# EAGLE board FPGA_S7 (EAGLE 9.6.2)
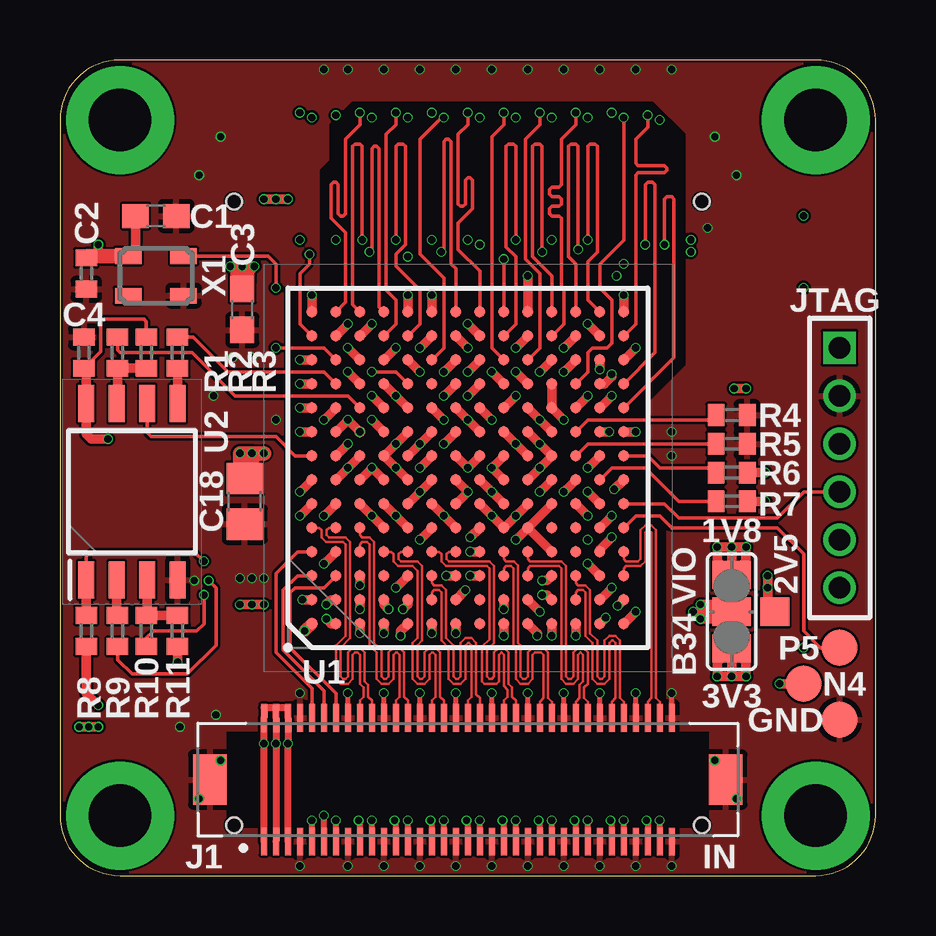
[diagram p3: board, top side]
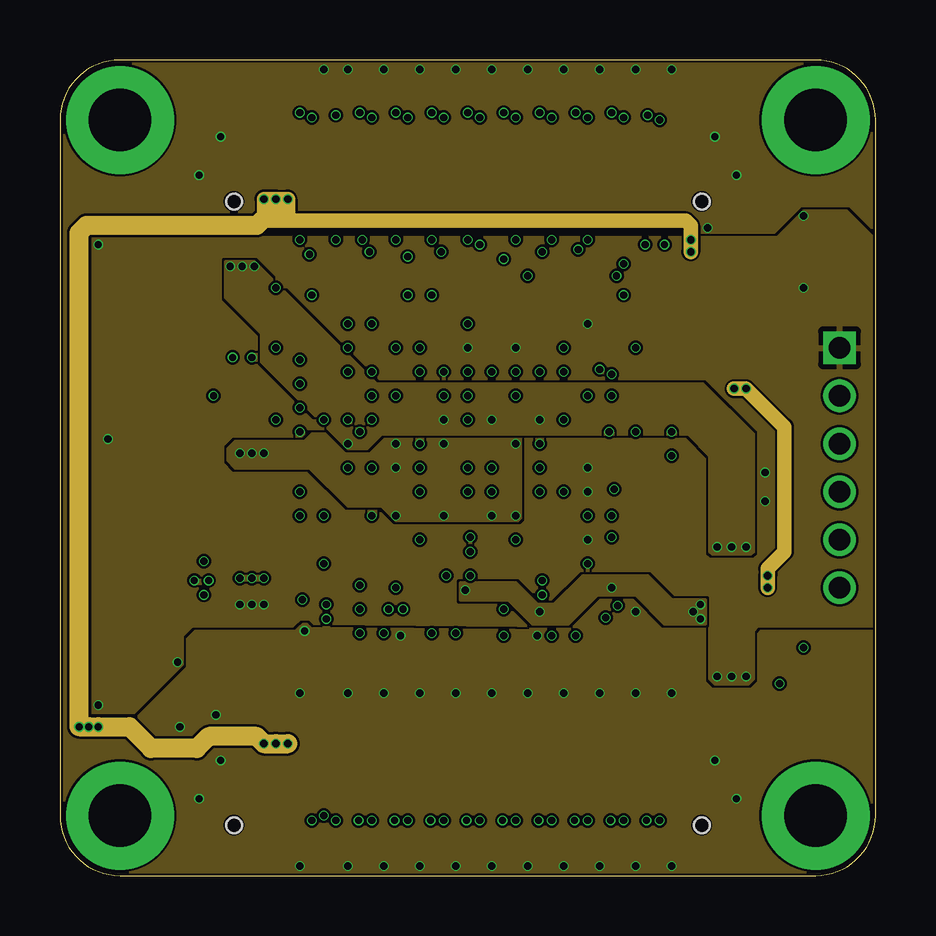
[diagram p4: board, inner layer Route2]
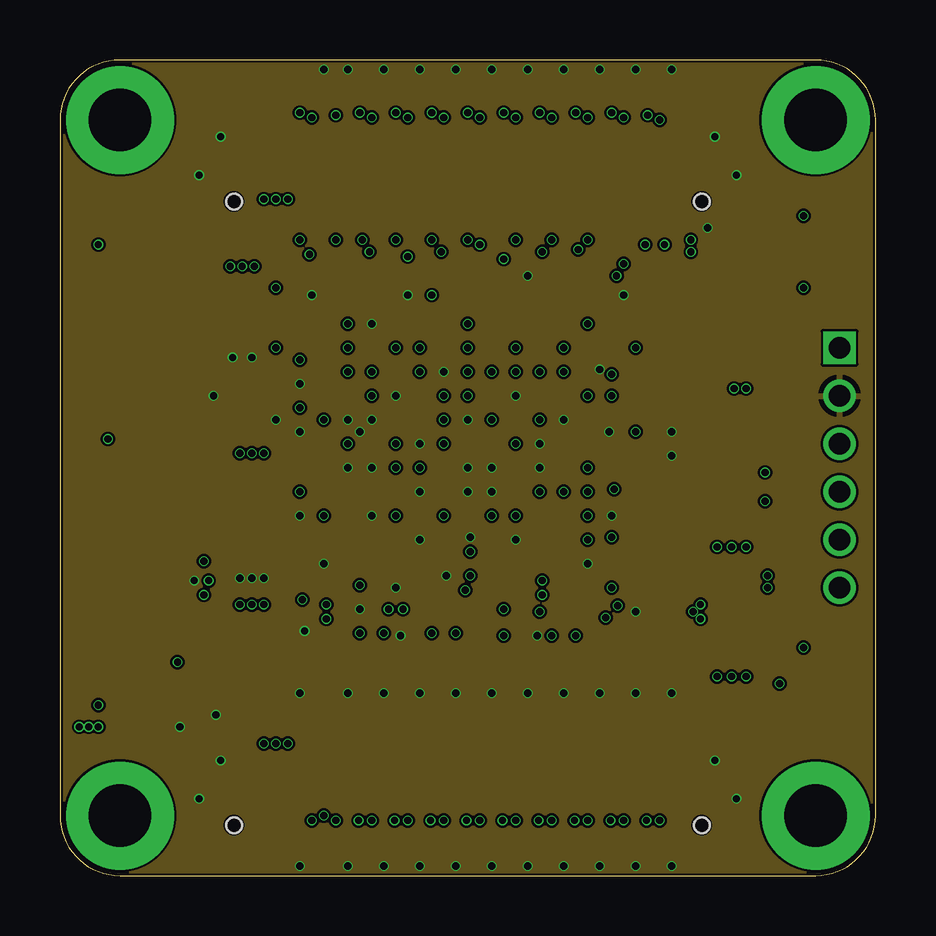
[diagram p5: board, inner layer Route3]
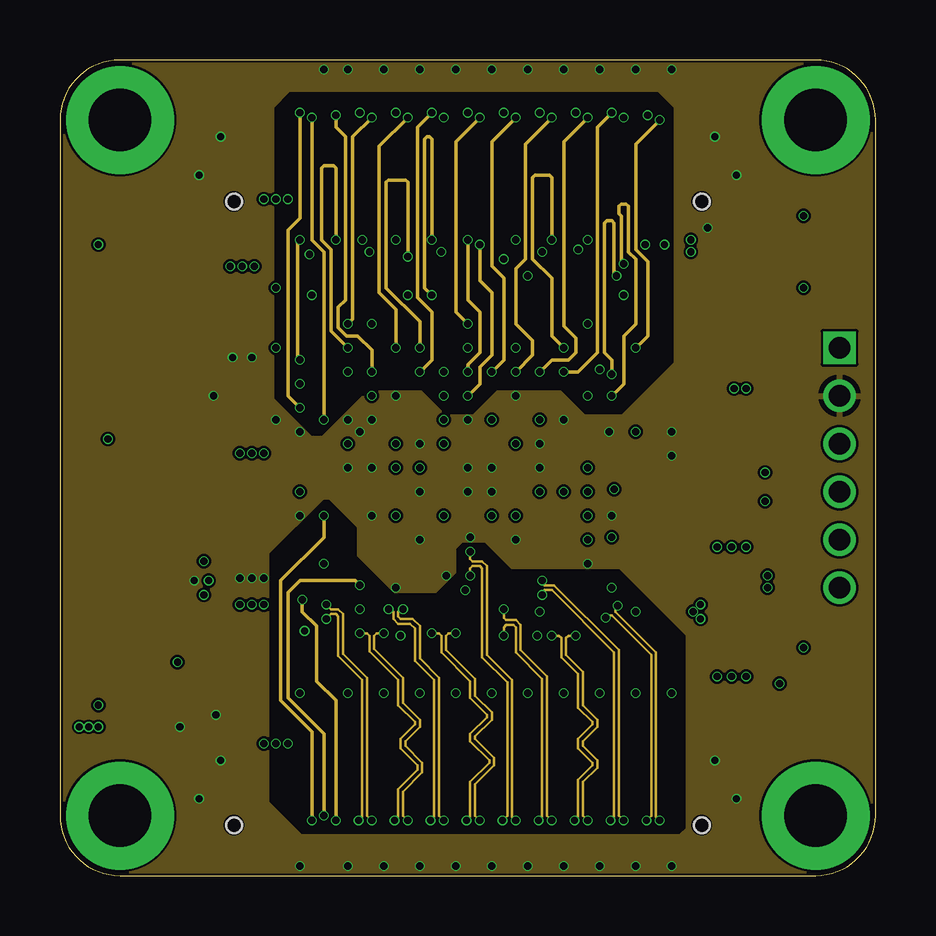
[diagram p6: board, inner layer Route14]
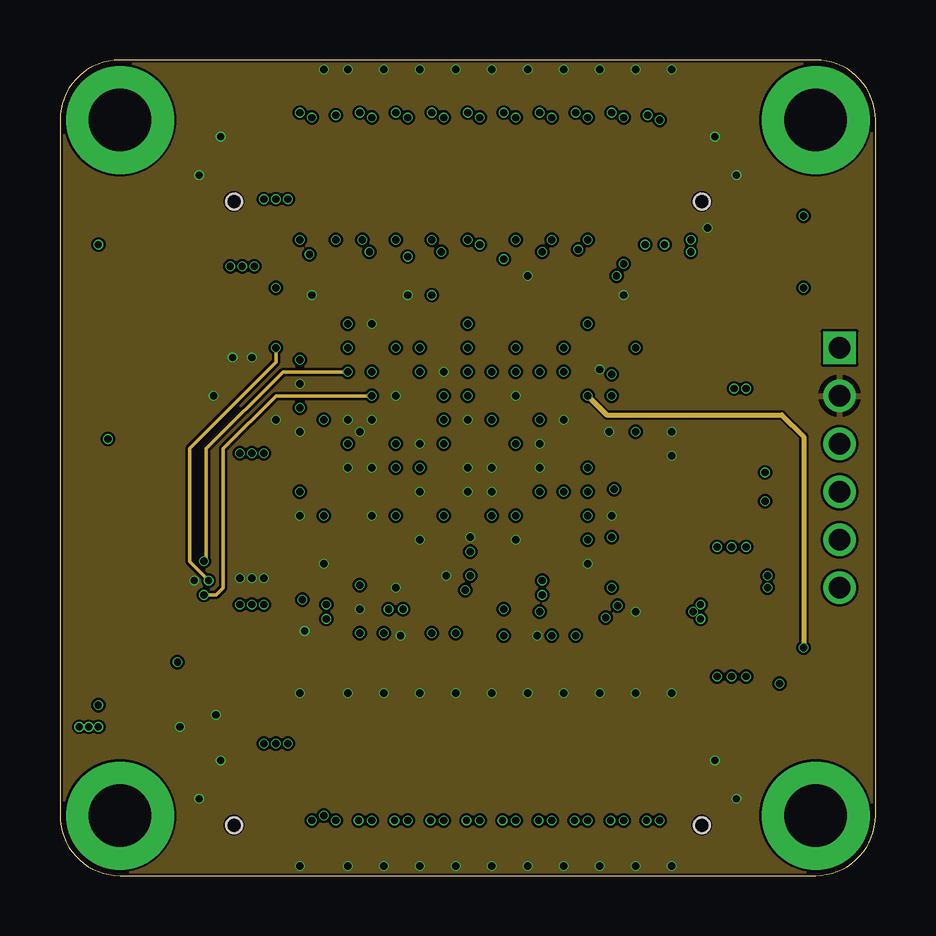
[diagram p7: board, inner layer Route15]
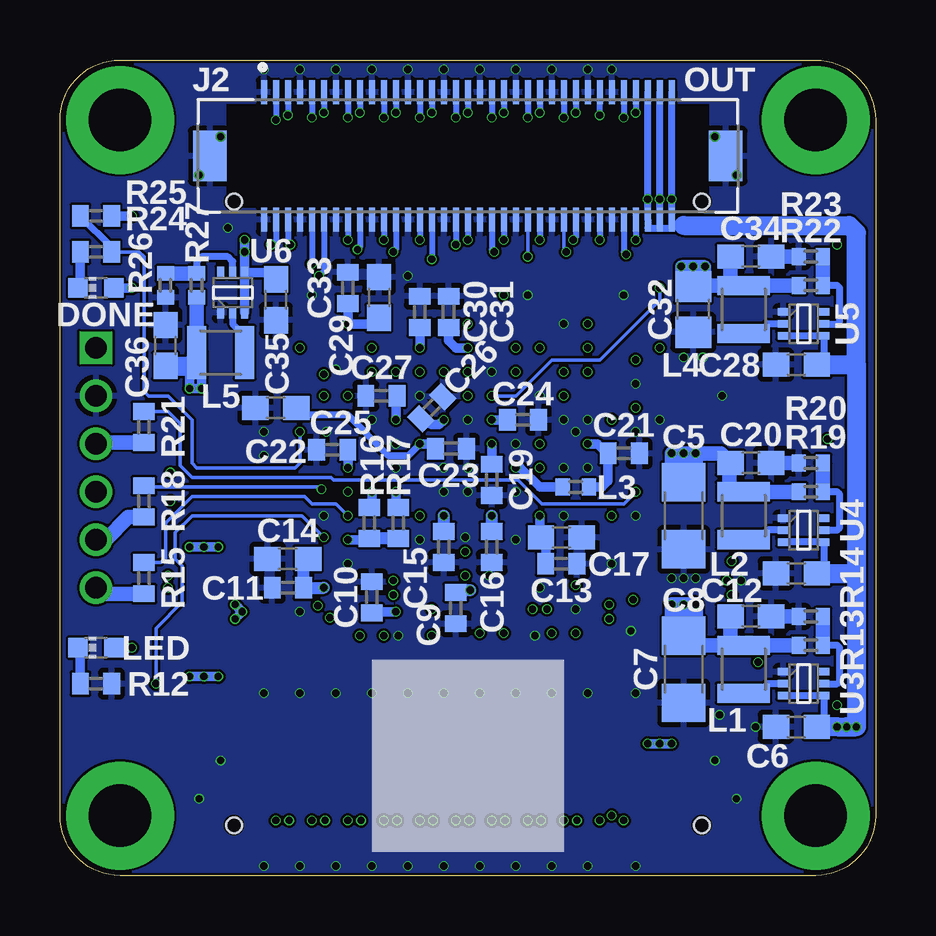
[diagram p8: board, bottom side, seen from below]

Size 34 x 34 mm. Coordinates in mm from the lower left corner, seen from the top.
Outline: 0,31.5 0,2.5 arc90 2.5,0 31.5,0 arc90 34,2.5 34,31.5 arc90 31.5,34 2.5,34 arc90 0,31.5
Copper layers (1+2*3+14*15+16): Top 0.035559375mm / dielectric 0.17018125mm / Route2 0.01778125mm / dielectric 47mil / Route3 0.0356mm / dielectric 0.2007mm / Route14 0.0356mm / dielectric 0.1499mm / Route15 0.01778125mm / dielectric 0.17018125mm / Bottom 0.035559375mm
Design rules "jlcpcb-4-layer *": minimum track width 0.08mm, minimum drill 0.2mm, track to track 0.1mm, track to pad 5mil, pad to pad 5mil, via to via 5mil, smd to smd 0mil, copper to edge 0.1mm, drill to drill 5mil, minimum pad ring 4mil, minimum via ring 0.05mm, stop-mask expansion 3mil, vias tented up to drill 100mil, thermal gap 8mil
Net classes: 0 default: width 0.14 mm, drill 0.3 mm
tRestrict: 4 lines

## Footprints (pad centres in the part's own frame; a part is rotated, then mirrored left to right if it is on the bottom)
TP12SQ = smd 1.2 x 1.2: TP 0,0
SJ_2 = smd 1.168 x 1.6: 1 -1.524,0; 2 0,0; 3 1.524,0
C0603 = smd 1.1 x 1: 1 -0.85,0; 2 0.85,0
C0402 = smd 0.7 x 0.9: 1 -0.65,0; 2 0.65,0
C1206 = smd 1.6 x 1.8: 1 -1.4,0; 2 1.4,0
C0805 = smd 1.3 x 1.5: 1 -0.95,0; 2 0.95,0
CHIP-LED0603 = smd 0.8 x 0.8: A 0,-0.75; C 0,0.75
TP15R = smd 1.5 x 1.5: TP 0,0
DF17(2.0)-70DP-0.5V(57) = smd 0.25 x 1.15: 1 -8.5,-2.575; 2 -8.5,2.575; 3 -8,-2.575; 4 -8,2.575; 5 -7.5,-2.575; 6 -7.5,2.575; 7 -7,-2.575; 8 -7,2.575; 9 -6.5,-2.575; 10 -6.5,2.575; 11 -6,-2.575; 12 -6,2.575; 13 -5.5,-2.575; 14 -5.5,2.575; 15 -5,-2.575; 16 -5,2.575; 17 -4.5,-2.575; 18 -4.5,2.575; 19 -4,-2.575; 20 -4,2.575; 21 -3.5,-2.575; 22 -3.5,2.575; 23 -3,-2.575; 24 -3,2.575; 25 -2.5,-2.575; 26 -2.5,2.575; 27 -2,-2.575; 28 -2,2.575; 29 -1.5,-2.575; 30 -1.5,2.575; 31 -1,-2.575; 32 -1,2.575; 33 -0.5,-2.575; 34 -0.5,2.575; 35 0,-2.575; 36 0,2.575; 37 0.5,-2.575; 38 0.5,2.575; 39 1,-2.575; 40 1,2.575; 41 1.5,-2.575; 42 1.5,2.575; 43 2,-2.575; 44 2,2.575; 45 2.5,-2.575; 46 2.5,2.575; 47 3,-2.575; 48 3,2.575; 49 3.5,-2.575; 50 3.5,2.575; 51 4,-2.575; 52 4,2.575; 53 4.5,-2.575; 54 4.5,2.575; 55 5,-2.575; 56 5,2.575; 57 5.5,-2.575; 58 5.5,2.575; 59 6,-2.575; 60 6,2.575; 61 6.5,-2.575; 62 6.5,2.575; 63 7,-2.575; 64 7,2.575; 65 7.5,-2.575; 66 7.5,2.575; 67 8,-2.575; 68 8,2.575; 69 8.5,-2.575; 70 8.5,2.575 | smd 1.4 x 2.1: S1 -10.75,0; S2 10.75,0 | hole 0.65: -9.75,-1.9; 9.75,-1.9
DF17(3.0)-70DS-0.5V(57) = smd 0.25 x 1: 1 -8.5,2.65; 2 -8.5,-2.65; 3 -8,2.65; 4 -8,-2.65; 5 -7.5,2.65; 6 -7.5,-2.65; 7 -7,2.65; 8 -7,-2.65; 9 -6.5,2.65; 10 -6.5,-2.65; 11 -6,2.65; 12 -6,-2.65; 13 -5.5,2.65; 14 -5.5,-2.65; 15 -5,2.65; 16 -5,-2.65; 17 -4.5,2.65; 18 -4.5,-2.65; 19 -4,2.65; 20 -4,-2.65; 21 -3.5,2.65; 22 -3.5,-2.65; 23 -3,2.65; 24 -3,-2.65; 25 -2.5,2.65; 26 -2.5,-2.65; 27 -2,2.65; 28 -2,-2.65; 29 -1.5,2.65; 30 -1.5,-2.65; 31 -1,2.65; 32 -1,-2.65; 33 -0.5,2.65; 34 -0.5,-2.65; 35 0,2.65; 36 0,-2.65; 37 0.5,2.65; 38 0.5,-2.65; 39 1,2.65; 40 1,-2.65; 41 1.5,2.65; 42 1.5,-2.65; 43 2,2.65; 44 2,-2.65; 45 2.5,2.65; 46 2.5,-2.65; 47 3,2.65; 48 3,-2.65; 49 3.5,2.65; 50 3.5,-2.65; 51 4,2.65; 52 4,-2.65; 53 4.5,2.65; 54 4.5,-2.65; 55 5,2.65; 56 5,-2.65; 57 5.5,2.65; 58 5.5,-2.65; 59 6,2.65; 60 6,-2.65; 61 6.5,2.65; 62 6.5,-2.65; 63 7,2.65; 64 7,-2.65; 65 7.5,2.65; 66 7.5,-2.65; 67 8,2.65; 68 8,-2.65; 69 8.5,2.65; 70 8.5,-2.65 | smd 1.4 x 2.1: S1 -10.75,0; S2 10.75,0 | hole 0.65: -9.75,-1.9; 9.75,-1.9
1X06M = drill 0.914 square: 1 -5,0 | drill 0.914: 2 -3,0; 3 -1,0; 4 1,0; 5 3,0; 6 5,0
L1008 = smd 0.8 x 2.2: 1 -1,0; 2 1,0
C0402' = smd 0.6 x 0.7: 1 -0.55,0; 2 0.55,0
R0402 = smd 0.7 x 0.9: 1 -0.65,0; 2 0.65,0
R0402' = smd 0.6 x 0.7: 1 -0.5,0; 2 0.5,0
BGA196C100P14X14_1500X1500X155 = smd 0.45 x 0.45: A1 -6.5,6.5; A2 -5.5,6.5; A3 -4.5,6.5; A4 -3.5,6.5; A5 -2.5,6.5; A6 -1.5,6.5; A7 -0.5,6.5; A8 0.5,6.5; A9 1.5,6.5; A10 2.5,6.5; A11 3.5,6.5; A12 4.5,6.5; A13 5.5,6.5; A14 6.5,6.5; B1 -6.5,5.5; B2 -5.5,5.5; B3 -4.5,5.5; B4 -3.5,5.5; B5 -2.5,5.5; B6 -1.5,5.5; B7 -0.5,5.5; B8 0.5,5.5; B9 1.5,5.5; B10 2.5,5.5; B11 3.5,5.5; B12 4.5,5.5; B13 5.5,5.5; B14 6.5,5.5; C1 -6.5,4.5; C2 -5.5,4.5; C3 -4.5,4.5; C4 -3.5,4.5; C5 -2.5,4.5; C6 -1.5,4.5; C7 -0.5,4.5; C8 0.5,4.5; C9 1.5,4.5; C10 2.5,4.5; C11 3.5,4.5; C12 4.5,4.5; C13 5.5,4.5; C14 6.5,4.5; D1 -6.5,3.5; D2 -5.5,3.5; D3 -4.5,3.5; D4 -3.5,3.5; D5 -2.5,3.5; D6 -1.5,3.5; D7 -0.5,3.5; D8 0.5,3.5; D9 1.5,3.5; D10 2.5,3.5; D11 3.5,3.5; D12 4.5,3.5; D13 5.5,3.5; D14 6.5,3.5; E1 -6.5,2.5; E2 -5.5,2.5; E3 -4.5,2.5; E4 -3.5,2.5; E5 -2.5,2.5; E6 -1.5,2.5; E7 -0.5,2.5; E8 0.5,2.5; E9 1.5,2.5; E10 2.5,2.5; E11 3.5,2.5; E12 4.5,2.5; E13 5.5,2.5; E14 6.5,2.5; F1 -6.5,1.5; F2 -5.5,1.5; F3 -4.5,1.5; F4 -3.5,1.5; F5 -2.5,1.5; F6 -1.5,1.5; F7 -0.5,1.5; F8 0.5,1.5; F9 1.5,1.5; F10 2.5,1.5; F11 3.5,1.5; F12 4.5,1.5; F13 5.5,1.5; F14 6.5,1.5; G1 -6.5,0.5; G2 -5.5,0.5; G3 -4.5,0.5; G4 -3.5,0.5; G5 -2.5,0.5; G6 -1.5,0.5; G7 -0.5,0.5; G8 0.5,0.5; G9 1.5,0.5; G10 2.5,0.5; G11 3.5,0.5; G12 4.5,0.5; G13 5.5,0.5; G14 6.5,0.5; H1 -6.5,-0.5; H2 -5.5,-0.5; H3 -4.5,-0.5; H4 -3.5,-0.5; H5 -2.5,-0.5; H6 -1.5,-0.5; H7 -0.5,-0.5; H8 0.5,-0.5; H9 1.5,-0.5; H10 2.5,-0.5; H11 3.5,-0.5; H12 4.5,-0.5; H13 5.5,-0.5; H14 6.5,-0.5; J1 -6.5,-1.5; J2 -5.5,-1.5; J3 -4.5,-1.5; J4 -3.5,-1.5; J5 -2.5,-1.5; J6 -1.5,-1.5; J7 -0.5,-1.5; J8 0.5,-1.5; J9 1.5,-1.5; J10 2.5,-1.5; J11 3.5,-1.5; J12 4.5,-1.5; J13 5.5,-1.5; J14 6.5,-1.5; K1 -6.5,-2.5; K2 -5.5,-2.5; K3 -4.5,-2.5; K4 -3.5,-2.5; K5 -2.5,-2.5; K6 -1.5,-2.5; K7 -0.5,-2.5; K8 0.5,-2.5; K9 1.5,-2.5; K10 2.5,-2.5; K11 3.5,-2.5; K12 4.5,-2.5; K13 5.5,-2.5; K14 6.5,-2.5; L1 -6.5,-3.5; L2 -5.5,-3.5; L3 -4.5,-3.5; L4 -3.5,-3.5; L5 -2.5,-3.5; L6 -1.5,-3.5; L7 -0.5,-3.5; L8 0.5,-3.5; L9 1.5,-3.5; L10 2.5,-3.5; L11 3.5,-3.5; L12 4.5,-3.5; L13 5.5,-3.5; L14 6.5,-3.5; M1 -6.5,-4.5; M2 -5.5,-4.5; M3 -4.5,-4.5; M4 -3.5,-4.5; M5 -2.5,-4.5; M6 -1.5,-4.5; M7 -0.5,-4.5; M8 0.5,-4.5; M9 1.5,-4.5; M10 2.5,-4.5; M11 3.5,-4.5; M12 4.5,-4.5; M13 5.5,-4.5; M14 6.5,-4.5; N1 -6.5,-5.5; N2 -5.5,-5.5; N3 -4.5,-5.5; N4 -3.5,-5.5; N5 -2.5,-5.5; N6 -1.5,-5.5; N7 -0.5,-5.5; N8 0.5,-5.5; N9 1.5,-5.5; N10 2.5,-5.5; N11 3.5,-5.5; N12 4.5,-5.5; N13 5.5,-5.5; N14 6.5,-5.5; P1 -6.5,-6.5; P2 -5.5,-6.5; P3 -4.5,-6.5; P4 -3.5,-6.5; P5 -2.5,-6.5; P6 -1.5,-6.5; P7 -0.5,-6.5; P8 0.5,-6.5; P9 1.5,-6.5; P10 2.5,-6.5; P11 3.5,-6.5; P12 4.5,-6.5; P13 5.5,-6.5; P14 6.5,-6.5
SOIC127P800X216-8N = smd 1.55 x 0.65: 1 -3.675,1.905; 2 -3.675,0.635; 3 -3.675,-0.635; 4 -3.675,-1.905; 5 3.675,-1.905; 6 3.675,-0.635; 7 3.675,0.635; 8 3.675,1.905
SOTFL50P160X60-6N = smd 0.475 x 0.3: 1 -0.838,0.5; 2 -0.838,0; 3 -0.838,-0.5; 4 0.838,-0.5; 5 0.838,0; 6 0.838,0.5
ASE = smd 1.1 x 0.65: 1 -1.15,-0.825; 2 1.15,-0.825; 3 1.15,0.825; 4 -1.15,0.825

## Placement (x,y rotation side)
2V5  TPTP12SQ  [TP12SQ]  29.8,11 0 top
B34  [SJ_2]  28,11 90 top
C1  4u7  [C0603]  4,27.5 180 top
C2  100n  [C0402]  1.1,25.1 270 top
C3  4u7  [C0603]  7.6,23.6 90 top
C4  100n  [C0402]  1,21.8 270 top
C5  100u  [C1206]  8,15 270 bottom
C6  4u7  [C0603]  3.3,6.2 180 bottom
C7  100u  [C1206]  8,8.6 270 bottom
C8  22u  [C0603]  5.2,10.8 0 bottom
C9  470n  [C0402]  17.5,11.15 90 bottom
C10  470n  [C0402]  21,11.6 270 bottom
C11  470n  [C0402]  24.5,12 0 bottom
C12  4u7  [C0603]  3.3,12.6 180 bottom
C13  47n  [C0402]  13.1,13 180 bottom
C14  4u7  [C0603]  24.5,13.2 0 bottom
C15  470n  [C0402]  18,13.7 90 bottom
C16  470n  [C0402]  16,13.7 90 bottom
C17  4u7  [C0603]  13.1,14.1 180 bottom
C18  47u  [C0805]  7.7,15.6 270 top
C19  470n  [C0402]  16,16.5 90 bottom
C20  22u  [C0603]  5.2,17.2 0 bottom
C21  47n  [C0402]  10.5,17.6 180 bottom
C22  470n  [C0402]  22.65,17.75 0 bottom
C23  47n  [C0402]  17.7,17.8 180 bottom
C24  470n  [C0402]  14.7,19 180 bottom
C25  4u7  [C0603]  25,19.5 0 bottom
C26  470n  [C0402]  18.5,19.5 225 bottom
C27  47n  [C0402]  20.6,20 0 bottom
C28  4u7  [C0603]  3.3,21.3 180 bottom
C29  4u7  [C0603]  20.7,24.1 270 bottom
C30  470n  [C0402]  19,23.5 270 bottom
C31  470n  [C0402]  17.8,23.5 270 bottom
C32  47u  [C0805]  7.6,23.6 90 bottom
C33  470n  [C0402]  22,24.5 270 bottom
C34  22u  [C0603]  5.2,25.8 0 bottom
C35  4u7  [C0603]  25,24 270 bottom
C36  22u  [C0603]  29.6,22.1 90 bottom
DONE  RED  [CHIP-LED0603]  32.5,24.5 90 bottom
GND  TPTP15R  [TP15R]  32.5,6.5 0 top
J1  DF17(2.0)-70DP-0.5V(57)  [DF17(2.0)-70DP-0.5V(57)]  17,4 0 top
J2  DF17(3.0)-70DS-0.5V(57)  [DF17(3.0)-70DS-0.5V(57)]  17,30 0 bottom
JTAG  [1X06M]  32.5,17 270 top
L1  1u  [L1008]  5.5,8.6 270 bottom
L2  1u  [L1008]  5.5,15 270 bottom
L3  L0402  [C0402']  12.5,16.2 0 bottom
L4  1u  [L1008]  5.5,23.6 270 bottom
L5  1u  [L1008]  27.3,21.8 0 bottom
LED  RED  [CHIP-LED0603]  32.5,9.5 90 bottom
N4  TPTP15R  [TP15R]  31,8 0 top
P5  TPTP15R  [TP15R]  32.5,9.5 0 top
R1  100R  [R0402]  2.4,21.8 270 top
R2  4k7  [R0402]  3.6,21.8 90 top
R3  100R  [R0402]  4.9,21.8 270 top
R4  1k  [R0402]  28,19.2 0 top
R5  1k  [R0402]  28,18 0 top
R6  4k7  [R0402]  28,16.8 0 top
R7  4k7  [R0402]  28,15.6 180 top
R8  4k7  [R0402]  1.1,10.2 270 top
R9  100R  [R0402]  2.4,10.2 270 top
R10  100R  [R0402]  3.6,10.2 270 top
R11  4k7  [R0402]  4.9,10.2 270 top
R12  1k  [R0402]  32.5,8 180 bottom
R13  453k  [R0402']  2.7,9.6 0 bottom
R14  100k  [R0402']  2.7,10.8 0 bottom
R15  100R  [R0402]  30.5,12.4 90 bottom
R16  1k  [R0402]  21.1,14.7 90 bottom
R17  4k7  [R0402]  19.9,14.7 90 bottom
R18  100R  [R0402]  30.5,15.6 90 bottom
R19  66k5  [R0402']  2.7,16 0 bottom
R20  100k  [R0402']  2.7,17.2 0 bottom
R21  100R  [R0402]  30.5,18.7 90 bottom
R22  200k  [R0402']  2.7,24.6 0 bottom
R23  100k  [R0402']  2.7,25.8 0 bottom
R24  1k  [R0402]  32.5,26 180 bottom
R25  1k  [R0402]  32.5,27.5 0 bottom
R26  66k5  [R0402']  29.6,24.6 90 bottom
R27  200k  [R0402']  28.3,24.6 90 bottom
U1  XC7S15-2FTGB196I  [BGA196C100P14X14_1500X1500X155]  17,17 90 top
U2  S25FL128LAGMFI010  [SOIC127P800X216-8N]  3,16 90 top
U3  TPS62A01ADRL  [SOTFL50P160X60-6N]  3,8 0 bottom
U4  TPS62A01ADRL  [SOTFL50P160X60-6N]  3,14.4 0 bottom
U5  TPS62A01ADRL  [SOTFL50P160X60-6N]  3,23 0 bottom
U6  TPS62A01ADRL  [SOTFL50P160X60-6N]  26.8,24.3 90 bottom
X1  50MHz  [ASE]  4,25 0 top

## Tracks (layer width: path | path; a pad name or v marks a point on that pad's centre or on a via)
1.0V  (via drill 0.3)
  Top 0.4: U1.D6 v14,15 U1.E5 | U1.F6 v16,15 U1.G5 | U1.H6 v18,15 U1.J5 v19,15 U1.K6 | U1.K8 v19,18 U1.J9 | U1.E7 v14,17 U1.D8 v14,18 U1.E9 | U1.G9 v16,18
  Top 0.6: v8,17.6 8,16.75 C18.1 7.5,16.65 v7.5,17.6 v8,17.6 | v8,17.6 v8.5,17.6
  Bottom 0.3: v19,18 U1.K8 20.3,17.5 22,19.2 23.85,19.2 C25.2
  Bottom 0.4: v19,18 18.6,18 18.4,17.8 C23.2 | v14,15 14,14.15 C17.2 13.75,13.9 C13.2 | C19.2 v16,18
  Bottom 0.5: C15.2 v18,15 | C16.2 v16,15
  Bottom 0.6: R19.1 L2.1 6,16 6.1,16.1 6.1,17.15 C20.1 6.45,17.6 v7.5,17.6 | v7.5,17.6 v8,17.6 | v8,17.6 v8.5,17.6 8.5,16.9 C5.1 | v8,17.6 C5.1 | v7.5,17.6 7.5,16.9 C5.1
  pour Route2 (rank 2): 7,17.8 7.3,18.1 10.2,18.1 10.5,18.4 19.2,18.4 19.2,14.9 19.1,14.8 14,14.8 13.4,15.4 12,15.4 10.4,17 7.3,17 7,17.3
1.8V  (via drill 0.3)
  Top 0.4: U1.L9 v20,19 U1.K10 | U1.H10 v18,19 | U1.F10 v16,19 | C3.2 7.6,24.65 7.3,24.95 7.3,25.2 v7.1,25.4 v7.6,25.4 | C3.2 7.9,24.75 7.9,25.2 v8.1,25.4 v7.6,25.4 | U1.B8 v12,18 | B34.3 v28,13.7 | B34.3 27.4,13.12 v27.4,13.7 v28,13.7 | B34.3 28.6,13.12 v28.6,13.7 v28,13.7 | C3.2 v7.6,25.4
  Bottom 0.4: v16,19 C24.2 | v20,19 20,19.95 C27.2 | C26.2 18.76,19.04 18.52,18.8 18.2,18.8 v18,19 | v12,18 11.6,18 11.2,17.6 C21.2 11.15,16.45 11.4,16.2 L3.2 | C32.2 v7.6,25.4 | v27.4,13.7 v28,13.7 v28.6,13.7
  Bottom 0.5: C32.2 7.1,24.88 v7.1,25.4 v7.6,25.4 v8.1,25.4 8.1,24.88 C32.2
  Bottom 0.6: R22.1 L4.1 | C34.1 6.05,24.75 6.2,24.6 L4.1 | L4.1 7.45,24.6 C32.2
  pour Route2: 6.9,25.6 8.1,25.6 13.2,20.5 26.8,20.5 28.9,18.4 28.9,13.5 28.8,13.4 27.2,13.4 27.1,13.5 27.1,17.5 26.2,18.4 13.4,18.4 12.8,17.8 12,17.8 8.4,21.4 8.4,22.6 6.9,24.1
2.5V  (via drill 0.3)
  Top 0.4: 2V5.TP 29.5,11.3 v29.5,12 v29.5,12.5 | v28.6,20.3 v28.1,20.3
  Route2 0.6: v28.1,20.3 v28.6,20.3 30.2,18.7 30.2,13.5 29.5,12.8 v29.5,12.5 v29.5,12
  Bottom 0.4: L5.1 28.1,21.6 v28.1,20.3 v28.6,20.3 28.6,21.5 L5.1
  Bottom 0.6: L5.1 R27.1
  Bottom 0.8: C36.1 28.45,21.25 28.3,21.4 L5.1
3.3V  (via drill 0.3)
  Top 0.15: C4.2 1.7,21.85 1.7,23.1 1.8,23.2 3.5,23.2 3.6,23.1 R2.2
  Top 0.3: 1.1,21.05 C4.2
  Top 0.4: U1.N8 v22,17 | U1.N6 v22,16 | R6.2 v29.4,16.8 | v1.6,26.3 1.6,26.05 1.3,25.75 C2.1 | C1.2 3.15,26.12 X1.4 | R7.1 v29.4,15.6 | 1.1,21.05 U2.8 1.1,18.41 1.3,18.2 v2,18.2 | R11.2 v4.9,8.9 | v1.6,7.1 1.1,7.6 R8.2 | B34.1 v28,8.3 | B34.1 28.6,8.88 v28.6,8.3 v28,8.3 | B34.1 27.4,8.88 v27.4,8.3 v28,8.3 | U1.G13 v17,22 | U1.K13 v19,22 | U1.N13 v22,23 | v7.5,11.3 v8,11.3 v8.5,11.3
  Top 0.6: C2.1 1.18,25.82 X1.4
  Bottom 0.4: C22.2 v22,17 | R16.1 21.15,14 v22,14 | R25.2 v31,27.5 | DONE.A v31,24.5 | v19,22 C30.2 | C33.2 v22,23 20.95,23 C29.2 | v17,22 17.5,22 17.8,22.3 C31.2 | v27.4,8.3 v28,8.3 v28.6,8.3
  Bottom 0.5: R17.1 R16.1
  Bottom 0.6: R13.1 L1.1 | C8.1 6.05,9.65 6,9.6 L1.1 | L1.1 7.6,9.6 C7.1 | C7.1 7.5,10.5 v7.5,11.3 v8,11.3 | C7.1 v8,11.3 | C7.1 8.5,10.5 v8.5,11.3 v8,11.3
  pour Route2 (rank 4): 1.3,26.6 29.9,26.6 31,27.7 32.8,27.7 34,26.5 34,10.4 29.1,10.4 28.9,10.2 28.9,8.2 28.7,8 27.3,8 27.1,8.2 27.1,10.3 27,10.4 25.2,10.4 24,11.6 22.4,11.6 21.2,10.4 10.6,10.5 10.4,10.7 10,10.7 9.7,10.4 5.5,10.4 5.1,10 5.1,8.8 3.1,6.8 1.3,6.8
50MHZ  (via drill 0.3)
  Top 0.15: X1.3 8.68,25.82 9,25.5 v9,24.5
  Top 0.4: U1.G11 v16,20
  Bottom 0.15: v16,20 15,20 13.5,21.5 11.5,21.5 9,24 v9,24.5
+5V  (via drill 0.3)
  Top 0.3: J1.3 J1.4 9,7 | J1.1 J1.2 8.5,7 9,7 | 9,7 9.5,7 J1.6 v9.5,5.5 J1.5
  Top 0.4: v0.8,6.2 v1.2,6.2 v1.6,6.2 | v8.5,28.2 v9,28.2 v9.5,28.2
  Route2 0.6: v9,28.2 v9.5,28.2 9.5,27.3 | v26.3,26 26.3,27.1 26.1,27.3 9.5,27.3 | v9,28.2 v8.5,28.2 8.5,27.5 8.3,27.3 8.4,27.3 9,27.3 | 9.5,27.3 9,27.3 | v9,28.2 9,27.3
  Route2 0.8: v9.5,5.5 v9,5.5 v8.5,5.5 8.2,5.8 6.2,5.8 5.7,5.3 3.8,5.3 2.9,6.2 v1.6,6.2 v1.2,6.2 v0.8,6.2 0.8,26.8 1.1,27.1 8.2,27.1 8.4,27.3
  Bottom 0.3: U3.3 U3.4 2.16,6.26 2.1,6.2 | U4.3 U4.4 2.16,12.66 2.1,12.6 | U5.3 U5.4 2.16,21.36 2.1,21.3 | 8.5,27.1 8,27.1 | J2.69 v8.5,28.2 J2.70 8.5,27.1 | J2.67 v9,28.2 J2.68 9,27 | J2.65 v9.5,28.2 J2.66 9.5,27 9,27 | 9,27 8.5,27 8.5,27.1
  Bottom 0.4: v9.5,5.5 v9,5.5 v8.5,5.5 | U6.4 25.29,25.14 C35.1 | U6.3 U6.4 | U6.4 v26.3,26 v26.3,26.5
  Bottom 0.6: C28.1 2.1,21.3 | C12.1 2.1,12.6 | 2.1,6.2 C6.1
  Bottom 0.8: 2.1,21.3 0.8,21.3 | 2.1,12.6 0.8,12.6 | 0.8,21.3 0.8,12.6 | 0.8,12.6 v0.8,6.2 v1.2,6.2 v1.6,6.2 2.1,6.2 | 0.8,21.3 0.8,26.8 1.1,27.1 8,27.1
A2  (via drill 0.3)
  Top 0.25: J1.13 v11.5,2.3
  Top 0.4: U1.A2 v10.1,11.5
  Route14 0.15: v11.5,2.3 11.5,7.3 10.7,8.1 10.7,10.4 10.1,11 v10.1,11.5
A3
  Top 0.15: J1.12 11,7.7 9.3,9.4 9.3,11.9 9.9,12.5 U1.A3
A4
  Top 0.15: J1.10 10.5,7.8 9,9.3 9,12.6 9.9,13.5 U1.A4
A5
  Top 0.1: J1.18 12.5,7.3 12.65,7.45 12.65,7.85 12.5,8 12.5,9.2 12.4,9.3 12.3,9.3 12.2,9.2 12.2,8.2 12,8 11.7,8 11.5,8.2 11.5,9.6 11.9,10 11.9,13.8 11.8,13.9 11.1,13.9 10.9,14.1 10.9,14.4 10.8,14.5 U1.A5
B1  (via drill 0.3)
  Top 0.25: J1.17 12.5,2.25 v12.45,2.3
  Top 0.4: U1.B1 11.3,10.5 v11.1,10.7
  Route14 0.1: v11.1,10.7 11.3,10.9 11.5,10.9 11.6,10.8 11.6,9.15 12.6,8.15
  Route14 0.102: v12.45,2.3 12.6,2.45 12.6,8.15
B2  (via drill 0.3)
  Top 0.25: J1.19 v13,2.3
  Top 0.4: U1.B2 11.3,11.5 v11.1,11.3
  Route14 0.1: v11.1,11.3 11.3,11.1 11.6,11.1 11.8,10.9 11.8,9.25 12.8,8.25
  Route14 0.102: v13,2.3 12.8,2.5 12.8,8.25
B3
  Top 0.15: U1.B3 11,12 9.8,12 9.6,11.8 9.6,9.5 11.5,7.6 J1.14
B5
  Top 0.1: J1.20 13,7.3 12.85,7.45 12.85,7.95 12.7,8.1 12.7,9.3 12.5,9.5 12.2,9.5 12,9.3 12,8.3 11.9,8.2 11.8,8.2 11.7,8.3 11.7,9.5 12.1,9.9 12.1,13.9 11.9,14.1 11.22,14.1 11.12,14.2 11.12,14.4 11.22,14.5 U1.B5
B6  (via drill 0.3)
  Top 0.25: J1.9 v10.5,2.3
  Top 0.4: U1.B6 v11,15
  Route14 0.15: v10.5,2.3 10.5,6 9.2,7.3 9.2,12.3 11,14.1 v11,15
C1  (via drill 0.3)
  Top 0.25: J1.23 14,2.25 v13.95,2.3
  Top 0.4: U1.C1 v12.5,10.1
  Route14 0.1: v13.95,2.3 14.1,2.45 14.1,3.6 14.9,4.4 14.9,4.6 14.2,5.3 14.2,5.7 14.8,6.3 14.8,6.4 14.1,7.1 14.1,8.15 12.9,9.35 12.9,10 12.8,10.1 v12.5,10.1
C3  (via drill 0.3)
  Top 0.25: J1.11 v11,2.5
  Top 0.4: U1.C3 v12.5,12.1
  Route14 0.15: v11,2.5 11,5.9 9.5,7.4 9.5,11.8 10,12.3 12.3,12.3 v12.5,12.1
C4
  Top 0.1: U1.C4 12.5,13.8 12.6,13.9 12.8,13.9 12.9,13.8 12.9,9.6 13.2,9.3 13.2,8.2 13.4,8 13.7,8 13.9,8.2 13.9,9.2 14,9.3 14.05,9.3 14.15,9.2 14.15,7.45 14,7.3 J1.24
C5
  Top 0.1: J1.26 14.5,7.3 14.35,7.45 14.35,9.3 14.15,9.5 13.9,9.5 13.7,9.3 13.7,8.3 13.6,8.2 13.5,8.2 13.4,8.3 13.4,9.4 13.1,9.7 13.1,13.9 12.9,14.1 12.6,14.1 12.5,14.2 U1.C5
D1  (via drill 0.3)
  Top 0.25: J1.25 v14.5,2.3
  Top 0.4: U1.D1 v13.5,10.1
  Route14 0.1: v14.5,2.3 14.3,2.5 14.3,3.5 15.1,4.3 15.1,4.7 14.4,5.4 14.4,5.6 15,6.2 15,6.5 14.3,7.2 14.3,8.25 13.1,9.45 13.1,10 13.2,10.1 v13.5,10.1
D2  (via drill 0.3)
  Top 0.15: U1.D2 13.5,11.3
  Top 0.25: J1.29 15.5,2.25 v15.45,2.3
  Top 0.4: v13.7,11.1 13.5,11.3
  Route14 0.1: v15.45,2.3 15.6,2.45 15.6,8.15 14.8,8.95 14.8,10.3 14.6,10.5 14.1,10.5 13.9,10.7 13.9,11 13.8,11.1 v13.7,11.1
D4
  Top 0.1: J1.30 15.5,7.3 15.65,7.45 15.65,9.2 15.55,9.3 15.5,9.3 15.4,9.2 15.4,8.2 15.2,8 14.9,8 14.7,8.2 14.7,9.7 14.9,9.9 14.9,12.7 14.7,12.9 14.1,12.9 13.9,13.1 13.9,13.4 13.8,13.5 U1.D4
E2  (via drill 0.3)
  Top 0.25: J1.31 v16,2.3
  Top 0.4: U1.E2 14.5,11.3 v14.3,11.1
  Route14 0.1: v16,2.3 15.8,2.5 15.8,8.25 15,9.05 15,10.4 14.7,10.7 14.2,10.7 14.1,10.8 14.1,11 14.2,11.1 v14.3,11.1
E4
  Top 0.1: U1.E4 14.22,13.5 14.12,13.4 14.12,13.2 14.22,13.1 14.9,13.1 15.1,12.9 15.1,9.8 14.9,9.6 14.9,8.3 15,8.2 15.1,8.2 15.2,8.3 15.2,9.3 15.4,9.5 15.65,9.5 15.85,9.3 15.85,7.45 16,7.3 J1.32
F1  (via drill 0.3)
  Top 0.25: J1.35 17,2.25 v16.95,2.3
  Top 0.4: U1.F1 v15.5,10.1
  Route14 0.1: v16.95,2.3 17.1,2.45 17.1,3.9 17.9,4.7 17.9,4.8 17.1,5.6 17.1,5.9 17.8,6.6 17.8,6.7 17.1,7.4 17.1,8.1 15.9,9.3 15.9,10 15.8,10.1 v15.5,10.1
F2
  Top 0.1: J1.36 17,7.3 17.15,7.45 17.15,9.6 17.05,9.7 17,9.7 16.9,9.6 16.9,8.2 16.7,8 16.4,8 16.2,8.2 16.2,9.5 15.9,9.8 15.9,11.8 15.8,11.9 15.6,11.9 15.5,11.8 U1.F2
F3
  Top 0.1: J1.38 17.5,7.4 17.35,7.55 17.35,9.7 17.15,9.9 16.9,9.9 16.7,9.7 16.7,8.3 16.6,8.2 16.5,8.2 16.4,8.3 16.4,9.6 16.1,9.9 16.1,11.9 15.9,12.1 15.6,12.1 15.5,12.2 U1.F3
F4
  Top 0.1: J1.42 18.5,7.3 18.65,7.45 18.65,7.75 18.5,7.9 18.5,9.2 18.4,9.3 18.3,9.2 18.3,8.1 18.2,8 17.7,8 17.6,8.1 17.6,9.55 17.9,9.85 17.9,12.8 17.8,12.9 16.1,12.9 15.9,13.1 15.9,13.4 15.8,13.5 U1.F4
FLASH_!CS  (via drill 0.3)
  Top 0.15: U2.1 1.1,13.29 1.3,13.5 5.6,13.5 v6,13.1
  Top 0.4: U1.C11 v12,21 | U2.1 R8.1
  Route15 0.15: v6,13.1 6.1,13.2 6.1,17.8 9.3,21 v12,21
FLASH_DQ0
  Top 0.15: U1.B11 11,21 7,21 5.55,22.45 R3.1
FLASH_DQ1  (via drill 0.3)
  Top 0.15: U1.B12 11,22 v9,22 | R9.2 2.4,9 3,8.4 5.3,8.4 6.5,9.6 6.5,12 v6.2,12.3
  Route15 0.15: v6.2,12.3 5.4,13.1 5.4,17.8 9,21.4 v9,22
FLASH_DQ2  (via drill 0.3)
  Top 0.15: R10.2 3.6,9.9 3.9,10.2 5.7,10.2 6,10.5 v6,11.7
  Top 0.4: U1.D10 v13,20
  Route15 0.15: v6,11.7 6.5,11.7 6.8,12 6.8,17.8 9,20 v13,20
FLASH_DQ3
  Top 0.15: U1.C10 12,20 7.3,20 5.5,21.8 2.5,21.8 2.4,21.9 R1.1
FLASH_SCK
  Top 0.15: U1.A8 9.8,17.5 9,18.3 3.8,18.3 3.63,18.46 U2.6
FPGA_B13  (via drill 0.3)
  Top 0.4: U1.B13 v12,23
  Route14 0.14: v12,23 12.2,23.2 12.2,30.8 v13,31.6
  Bottom 0.25: J2.51 v13,31.6
FPGA_B14  (via drill 0.3)
  Top 0.14: U1.B14 11.9,23.9 11.9,26.8 11.3,27.4 11.3,28.8 11.4,28.9 11.5,28.9 11.6,28.8 11.6,27.6 11.7,27.5 11.8,27.5 11.9,27.6 11.9,30.7 12.5,31.3 v12.5,31.8
  Bottom 0.25: J2.53 v12.5,31.8
FPGA_C12  (via drill 0.3)
  Top 0.4: U1.C12 v12,22
  Route14 0.14: v12,22 11.3,22.7 11.3,26.1 10.9,26.5 10.9,29.5 11,29.6 11.4,29.6 11.5,29.5 v11.5,26.5
  Bottom 0.25: J2.58 v11.5,26.5
FPGA_C14  (via drill 0.3)
  Top 0.14: U1.C14 12.2,23.8 12.2,30.4 12.3,30.5 12.5,30.5 12.6,30.4 v12.6,26.5
  Bottom 0.25: J2.54 12.5,26.6 v12.6,26.5
FPGA_D12  (via drill 0.3)
  Top 0.4: U1.D12 v14,22
  Route14 0.14: v14,22 14,23.6 13.3,24.3 13.3,30.4 v14.5,31.6
  Bottom 0.25: J2.45 v14.5,31.6
FPGA_D13  (via drill 0.3)
  Top 0.14: U1.D13 14,23 14,24 13.6,24.4 13.6,30.9 14,31.3 v14,31.8
  Bottom 0.25: J2.47 v14,31.8
FPGA_D14  (via drill 0.3)
  Top 0.14: U1.D14 13.3,23.7 13.3,30.3 13.2,30.4 13.1,30.4 13,30.3 13,26.1 v12.9,26
  Bottom 0.14: J2.52 13,26.1 v12.9,26
FPGA_E11  (via drill 0.3)
  Top 0.14: U1.E11 14,21 v13,21
  Route14 0.14: v13,21 13,21.9 12.4,22.5 11.94,22.5 11.6,22.84 11.6,23.7 11.9,24 11.9,30.8 11.5,31.2 v11.5,31.7
  Bottom 0.25: v11.5,31.7 J2.57
FPGA_E12  (via drill 0.3)
  Top 0.4: U1.E12 v15,21
  Route14 0.14: v15,21 15.5,21.5 15.5,23.5 14.9,24.1 14.9,31.2 v15.5,31.8
  Bottom 0.25: J2.41 v15.5,31.8
FPGA_E13  (via drill 0.3)
  Top 0.14: U1.E13 15,23 15,24.4 14,25.4 14,25.9 14.4,26.3 14.4,30.4 14.3,30.5 14.1,30.5 14,30.4 v14,26.5
  Bottom 0.25: J2.48 v14,26.5
FPGA_F12  (via drill 0.3)
  Top 0.14: U1.F12 16,22 16,24.9 15,25.9 15,30.7 15.9,31.6 v16,31.6
  Bottom 0.25: J2.39 v16,31.6
FPGA_F13  (via drill 0.3)
  Top 0.4: U1.F13 v15,22
  Route14 0.14: v15,22 15,23.1 13.6,24.5 13.6,28.9 13.7,29 14.4,29 14.5,28.9 v14.5,25.8
  Bottom 0.14: J2.46 v14.5,25.8
FPGA_F14  (via drill 0.3)
  Top 0.4: U1.F14 v15.5,24.2
  Route14 0.14: v15.5,24.2 15.2,24.5 15.2,30.7 15.3,30.8 15.4,30.8 15.5,30.7 v15.5,26.5
  Bottom 0.25: J2.42 v15.5,26.5
FPGA_G14  (via drill 0.3)
  Top 0.14: U1.G14 16.5,25.3 16.3,25.5 16.3,30.6 16.2,30.7 16.1,30.7 16,30.6 16,26.1 v15.9,26
  Bottom 0.25: J2.40 16,26.1 v15.9,26
FPGA_H11  (via drill 0.3)
  Top 0.4: U1.H11 v17,20
  Route14 0.15: v17,20 U1.H11 17.5,21.2 18,21.7 18,24.3 17.5,24.8 v17.5,26.3
  Bottom 0.25: J2.34 v17.5,26.3
FPGA_H12  (via drill 0.3)
  Top 0.4: U1.H12 v17,21
  Route14 0.15: v17,21 17,21.3 17.5,21.8 17.5,23.5 17,24 v17,26.5
  Bottom 0.25: J2.36 v17,26.5
FPGA_H13  (via drill 0.3)
  Top 0.4: U1.H13 v17,23
  Route14 0.14: v17,23 16.5,23.5 16.5,30.6 v17.5,31.6
  Bottom 0.25: J2.33 v17.5,31.6
FPGA_H14  (via drill 0.3)
  Top 0.14: U1.H14 17.5,25.2 16.6,26.1 16.6,27.2 17.2,27.8 17.2,29 17.1,29.1 17,29.1 16.9,29 16.9,28 16.8,27.9 16.7,27.9 16.6,28 16.6,30.9 17,31.3 v17,31.8
  Bottom 0.25: J2.35 v17,31.8
FPGA_J11  (via drill 0.3)
  Top 0.4: U1.J11 v18,21
  Route14 0.14: v19,31.6 18,30.6 18,25.4 18.5,24.9 18.5,21.5 v18,21
  Bottom 0.25: J2.27 v19,31.6
FPGA_J12  (via drill 0.3)
  Top 0.14: U1.J12 18,22 18,30.8 18.5,31.3 v18.5,31.8
  Bottom 0.25: J2.29 v18.5,31.8
FPGA_J13  (via drill 0.3)
  Top 0.14: U1.J13 19,23 19,25.8 18.6,26.2 18.6,30.4 18.7,30.5 18.9,30.5 19,30.4 v19,26.5
  Bottom 0.25: J2.28 v19,26.5
FPGA_J14  (via drill 0.3)
  Top 0.15: U1.J14 v18.5,25.7
  Bottom 0.25: J2.30 v18.5,25.7
FPGA_K11  (via drill 0.3)
  Top 0.4: U1.K11 v19,21
  Route14 0.14: v20.5,31.6 19.4,30.5 19.4,25.7 19,25.3 19,23 19.7,22.3 19.7,21.7 v19,21
  Bottom 0.25: J2.21 v20.5,31.6
FPGA_K12  (via drill 0.3)
  Top 0.14: 20,25.1 19.4,25.7 19.4,30.7
  Top 0.15: 20,25.1 20,22 U1.K12 | v20,31.8 20,31.3 19.4,30.7
  Bottom 0.25: J2.23 v20,31.8
FPGA_L12  (via drill 0.3)
  Top 0.4: U1.L12 v20,21
  Route14 0.14: v20,21 U1.L12 21.2,21.5 21.5,21.8 21.5,22.4 21,22.9 21,30.6 v22,31.6
  Bottom 0.25: J2.15 v22,31.6
FPGA_L13  (via drill 0.3)
  Top 0.14: v21.5,31.8 21.5,31.3 20.9,30.7 20.9,28.8 20.8,28.7 20.5,28.7 20.4,28.6 20.4,28.4 20.5,28.3 20.8,28.3 20.9,28.2 20.9,28 20.8,27.9 20.5,27.9 20.4,27.8 20.4,27.6 20.5,27.5 20.8,27.5 20.9,27.4 20.9,24.5 21,24.4 21,23 U1.L13
  Bottom 0.25: J2.17 v21.5,31.8
FPGA_L14  (via drill 0.3)
  Top 0.14: v20.1,26 20.1,30.4 20,30.5 19.8,30.5 19.7,30.4 19.7,25.8 20.5,25 U1.L14
  Bottom 0.25: J2.24 20,26.1 v20.1,26
FPGA_M11  (via drill 0.3)
  Top 0.14: U1.M11 22,21 22,21.8 22.2,22 22.8,22 23,22.2 23,24 22.5,24.5 22.5,25.5 23.5,26.5 v23.5,31.6
  Bottom 0.25: J2.9 v23.5,31.6
FPGA_M12  (via drill 0.3)
  Top 0.4: U1.M12 v21,21
  Route14 0.14: v21,21 21.6,21 22.4,21.8 22.4,31.2 v23,31.8
  Bottom 0.25: J2.11 v23,31.8
FPGA_M13  (via drill 0.3)
  Top 0.4: U1.M13 v21,22
  Route14 0.14: v21,22 20.5,22.5 20.5,24.9 19.7,25.7 19.7,29.1 19.8,29.2 20.4,29.2 20.5,29.1 v20.5,26.5
  Bottom 0.25: J2.22 v20.5,26.5
FPGA_M14  (via drill 0.3)
  Top 0.14: U1.M14 21.5,25.5 21.2,25.8 21.2,30.4 21.3,30.5 21.5,30.5 21.6,30.4 v21.6,26.1
  Bottom 0.25: J2.18 21.5,26.2 v21.6,26.1
FPGA_N10  (via drill 0.3)
  Top 0.4: U1.N10 v23,20
  Route14 0.14: v23,20 23.5,20.5 23.5,22.5 24,23 24,25.7 23.7,26 23.7,27.9 23.6,28 23.4,28 23.3,27.9 23.3,27.6 23.4,27.5 23.4,25.6 v23.5,25.5
  Bottom 0.25: J2.10 v23.5,25.5
FPGA_N11  (via drill 0.3)
  Top 0.4: v23,20.9 23,20.8 22.7,20.5 U1.N11
  Route14 0.14: v23,20.9 23,21.5 22.7,21.8 22.7,27.2 22.8,27.3 23,27.3 23.1,27.2 23.1,25.1 v23.2,25
  Bottom 0.25: J2.12 23,25.2 v23.2,25
FPGA_N14  (via drill 0.3)
  Top 0.14: U1.N14 22,24 22,25.6 22.4,26 22.4,30.4 22.3,30.5 22.1,30.5 22,30.4 v22,26.5
  Bottom 0.25: J2.16 v22,26.5
FPGA_P10  (via drill 0.3)
  Top 0.14: v25.2,26.3 25.2,28.2 25.3,28.3 25.5,28.3 25.6,28.2 25.6,21.6 U1.P10
  Bottom 0.25: J2.4 25,26.5 v25.2,26.3
FPGA_P11  (via drill 0.3)
  Top 0.14: v24.4,26.3 24.4,28.8 24.5,28.9 24.7,28.9 24.8,28.8 24.8,21.8 U1.P11
  Bottom 0.25: J2.6 24.5,26.4 v24.4,26.3
FPGA_P12  (via drill 0.3)
  Top 0.4: U1.P12 v24,22
  Route14 0.14: v25,31.5 24,30.5 24,26.1 24.5,25.6 24.5,22.5 v24,22
  Bottom 0.25: J2.3 v25,31.5
FPGA_P13  (via drill 0.3)
  Top 0.14: U1.P13 24,23 24,29.2 24.1,29.3 25.2,29.3 25.3,29.4 25.3,29.5 25.2,29.6 24.1,29.6 24,29.7 24,30.7 24.5,31.2 v24.5,31.7
  Bottom 0.25: J2.5 v24.5,31.7
G1  (via drill 0.3)
  Top 0.25: J1.37 v17.5,2.3
  Top 0.4: U1.G1 v16.5,10.1
  Route14 0.1: v17.5,2.3 17.3,2.5 17.3,3.8 18.1,4.6 18.1,4.9 17.3,5.7 17.3,5.8 18,6.5 18,6.8 17.3,7.5 17.3,8.2 16.1,9.4 16.1,10 16.2,10.1 v16.5,10.1
G4
  Top 0.1: J1.44 19,7.3 18.85,7.45 18.85,7.85 18.7,8 18.7,9.3 18.5,9.5 18.3,9.5 18.1,9.3 18.1,8.3 18,8.2 17.9,8.2 17.8,8.3 17.8,9.4 18.1,9.7 18.1,12.9 17.9,13.1 16.22,13.1 16.12,13.2 16.12,13.4 16.22,13.5 U1.G4
GND  (via drill 0.3)
  Top 0.2: J1.16 v12,7.6 | J1.22 v13.5,7.6 | J1.28 v15,7.6 | J1.34 v16.5,7.6 | J1.40 v18,7.6 | J1.46 v19.5,7.6 | J1.52 v21,7.6 | J1.58 v22.5,7.6 | J1.64 v24,7.6 | J1.70 v25.5,7.6
  Top 0.4: U1.E6 v15,16 U1.F7 | U1.G6 v17,16 U1.G7 | U1.K9 v20,18 U1.L8 v20,17 U1.K7 | U1.A11 v10,20.5 | U1.A9 v10,18.5 | U1.C6 v13,15 U1.D5 | U1.J8 v18,17 U1.J7 | U1.C8 v12,17 U1.B7 | U1.C13 v13,23 | U1.D11 v14,20 U1.E10 | U1.G12 v16,21 | U1.E8 v15,18 U1.F9 | U1.C9 v12,19 U1.B9 | U1.D7 v13,17 U1.C7 | U1.A6 v10,15 | U1.E1 14.2,10.2 v14.2,10 | U1.B4 v11,13 | v19.9,10 19.9,10.1 U1.K1 | U1.E3 v14,12 | U1.E14 v14.5,24.2 | U1.A14 v10.5,24.2 | U1.K14 v19.5,25 | U1.P14 v23.5,24.2 | U1.C2 v12.5,11.1 | U1.N3 v22,13 | U1.H5 v17.1,14.1 | U1.P1 v24,11 | U1.N5 v23,15 | U1.K5 v19,14 | U1.F5 v15,14 | U1.L11 U1.L10 v21,19 | U1.N9 v22.9,18.5 | U1.N12 v22.5,21.1 | U1.J10 v19,20 | U1.J6 v18,16 U1.H7 | U1.L6 U1.K5 | U1.L4 U1.K5 | U1.D9 v13,19 | U1.G8 v17,17 U1.H8 | U1.G3 v16.1,12.5 | U1.G10 v17,19 U1.H9
  Top 0.5: U1.A1 v10.2,10.2
  Bottom 0.6: R23.1 C34.2 | R20.1 C20.2 | R14.1 C8.2
  other vias: 12.5,18.5 10,7.6 25.5,0.4 24,0.4 22.5,0.4 21,0.4 19.5,0.4 18,0.4 16.5,0.4 15,0.4 13.5,0.4 12,0.4 10,0.4 6.7,4.8 5.8,3.2 27.3,4.8 28.2,3.2 11,33.6 12,33.6 13.5,33.6 15,33.6 18,33.6 16.5,33.6 19.5,33.6 21,33.6 22.5,33.6 24,33.6 25.5,33.6 27.3,30.8 28.2,29.2 6.7,30.8 5.8,29.2 5,6.2 7.2,21.6 6.5,6.7 8,12.4 7.5,12.4 8.5,12.4 25.5,18.5 25.5,17.5 5.6,12.3 6.4,20 9,19 8,21.6 27,27
  pour Route2 (rank 6): 0,0 34,0 34,34 0,34
  pour Top: 0,0 34,0 34,34 0,34
  pour Bottom: 0,0 34,0 34,34 0,34
  pour Route15: 0,0 34,0 34,34 0,34
  cutout Top: 9.4,9.6 9.4,24.5 10.9,24.5 10.9,29.4 11.3,29.8 11.3,31.3 12.2,32.2 24.7,32.2 26,30.9 26,21.3 24.5,19.8 24.5,15.5 25.2,14.8 25.2,7 12,7
  pour Route3: 0,0 34,0 34,34 0,34
  pour Route14 (rank 2): 0,0 34,0 34,34 0,34
  cutout Route14: 9,32 9.6,32.6 24.9,32.6 25.5,32 25.5,21.4 23.4,19.3 21.9,19.3 20.9,20.3 18.2,20.3 17.2,19.3 16.1,19.3 15.1,20.3 12.8,20.3 10.9,18.4 10.5,18.4 9,19.9
  cutout Route14: 10.1,1.8 8.8,3.1 8.8,13.4 11,15.6 11.2,15.6 12.3,14.5 12.3,13.3 13.9,11.7 15.7,11.7 16.6,12.6 16.6,13.6 16.8,13.8 17.7,13.8 18.81,12.69 23.31,12.69 26,10 26,2 25.8,1.8
H3  (via drill 0.3)
  Top 0.25: J1.41 18.5,2.25 v18.45,2.3
  Top 0.4: U1.H3 v17.1,12.5
  Route14 0.1: v18.45,2.3 18.65,2.5 18.65,8.05 17.6,9.1 17.6,12.8 17.5,12.9 17.2,12.9 17.1,12.8 v17.1,12.5
H4  (via drill 0.3)
  Top 0.25: J1.43 v19,2.3
  Top 0.4: U1.H4 v17.1,13.5
  Route14 0.1: v19,2.3 18.85,2.45 18.85,8.15 17.8,9.2 17.8,12.9 17.6,13.1 17.2,13.1 17.1,13.2 v17.1,13.5
INIT
  Top 0.15: U1.P8 24.5,17.5 25,17 27.15,17 R6.1
J1  (via drill 0.3)
  Top 0.25: J1.47 20,2.25 v19.95,2.3
  Top 0.4: U1.J1 v18.5,10
  Route14 0.1: v19.95,2.3 20.1,2.45 20.1,8.2 19,9.3 19,10.35 18.9,10.45 18.6,10.45 18.5,10.35 v18.5,10
J2  (via drill 0.3)
  Top 0.25: J1.49 v20.5,2.3
  Top 0.4: U1.J2 v18.5,11.1
  Route14 0.1: v20.5,2.3 20.3,2.5 20.3,8.3 19.2,9.4 19.2,10.45 19,10.65 18.6,10.65 18.5,10.75 v18.5,11.1
J3
  Top 0.1: J1.48 20,7.25 20.15,7.4 20.15,9.2 20.05,9.3 19.8,9.3 19.7,9.2 19.7,8.2 19.5,8 19.2,8 19,8.2 19,9.5 18.9,9.6 18.9,12.8 18.8,12.9 18.6,12.9 18.5,12.8 U1.J3
J4
  Top 0.1: J1.50 20.5,7.25 20.35,7.4 20.35,9.3 20.15,9.5 19.7,9.5 19.5,9.3 19.5,8.3 19.4,8.2 19.3,8.2 19.2,8.3 19.2,9.6 19.1,9.7 19.1,12.93 18.93,13.1 18.6,13.1 18.5,13.2 U1.J4
K3
  Top 0.1: U1.K3 19.5,12.8 19.6,12.9 20.8,12.9 20.9,12.8 20.9,8.2 21.1,8 21.4,8 21.6,8.2 21.6,9.2 21.7,9.3 21.8,9.2 21.8,8.1 21.65,7.95 21.65,7.4 21.5,7.25 J1.54
K4
  Top 0.1: U1.K4 19.5,13.2 19.6,13.1 20.9,13.1 21.1,12.9 21.1,8.3 21.2,8.2 21.3,8.2 21.4,8.3 21.4,9.3 21.6,9.5 21.8,9.5 22,9.3 22,8 21.85,7.85 21.85,7.4 22,7.25 J1.56
L1  (via drill 0.3)
  Top 0.25: J1.53 21.5,2.25 v21.45,2.3
  Top 0.4: U1.L1 v20.5,10
  Route14 0.1: v21.45,2.3 21.6,2.45 21.6,4 22.2,4.6 22.2,4.7 21.6,5.3 21.6,5.7 22.2,6.3 22.2,6.4 21.6,7 21.6,8.4 20.9,9.1 20.9,9.9 20.8,10 v20.5,10
L2  (via drill 0.3)
  Top 0.2: 23,2.25 v22.95,2.3
  Top 0.25: J1.59 23,2.25
  Top 0.4: U1.L2 20.3,11.7 v20.1,11.7
  Route14 0.1: v22.95,2.3 23.1,2.45 23.1,9.3 20.5,11.9 20.2,11.9 20.1,11.8 v20.1,11.7
L3  (via drill 0.3)
  Top 0.25: J1.61 v23.5,2.3
  Top 0.4: U1.L3 20.3,12.3 v20.1,12.3
  Route14 0.1: v23.5,2.3 23.3,2.5 23.3,9.4 20.6,12.1 20.2,12.1 20.1,12.2 v20.1,12.3
LED  (via drill 0.3)
  Top 0.4: U1.M10 v22,20
  Route15 0.2: v22,20 22.8,19.2 30.1,19.2 31,18.3 v31,9.5
  Bottom 0.4: LED.A v31,9.5
M0_0  (via drill 0.3)
  Top 0.4: U1.M7 v21,16
  Bottom 0.15: R16.2 21,15.45
  Bottom 0.4: v21,16 21,15.45
M1  (via drill 0.3)
  Top 0.25: J1.55 v22,2.3
  Top 0.4: U1.M1 v21.5,10
  Route14 0.1: v22,2.3 21.8,2.5 21.8,3.9 22.4,4.5 22.4,4.8 21.8,5.4 21.8,5.6 22.4,6.2 22.4,6.5 21.8,7.1 21.8,8.5 21.1,9.2 21.1,9.9 21.2,10 v21.5,10
M1_0
  Top 0.15: U1.M8 22,18 R5.1
M2
  Top 0.1: J1.60 23,7.25 23.15,7.4 23.15,9.7 23.05,9.8 23,9.8 22.9,9.7 22.9,8.2 22.7,8 22.4,8 22.2,8.2 22.2,9.7 21.9,10 21.9,11.8 21.8,11.9 21.6,11.9 21.5,11.8 U1.M2
M2_0
  Top 0.15: U1.M9 22,19 27.15,19 R4.1
M3
  Top 0.1: J1.62 23.5,7.25 23.35,7.4 23.35,9.8 23.15,10 22.9,10 22.7,9.8 22.7,8.3 22.6,8.2 22.5,8.2 22.4,8.3 22.4,9.8 22.1,10.1 22.1,11.9 21.9,12.1 21.6,12.1 21.5,12.2 U1.M3
N1  (via drill 0.3)
  Top 0.25: v24.45,2.3 24.5,2.25 J1.65
  Top 0.4: U1.N1 v22.75,10.75
  Route14 0.1: v24.45,2.3 24.65,2.5 24.65,9.2 23,10.85 22.85,10.85 v22.75,10.75
N$00001  (via drill 2.6 pad 4.5)
  other vias: 31.5,31.5
N$00002  (via drill 2.6 pad 4.5)
  other vias: 2.5,31.5
N$00003  (via drill 0.3)
  Top 0.4: U1.F8 v15,17
  Bottom 0.4: L3.1 14,16.2 14.8,17 v15,17
N$00004
  Bottom 0.4: LED.C 33.15,9.4 R12.2
N$00005
  Bottom 0.3: U4.2 4.5,14.4 4.9,14 L2.2
N$00006
  Top 0.4: U2.7 2.4,19.71 R1.2 R2.1
N$00007  (via drill 2.6 pad 4.5)
  other vias: 2.5,2.5
N$00008  (via drill 2.6 pad 4.5)
  other vias: 31.5,2.5
N$00009
  Top 0.15: U1.N7 23,17 24.4,17 25.8,15.6 R7.2
N$00010
  Top 0.4: U2.5 R3.2
N$00011
  Top 0.4: U2.2 2.37,10.88 R9.1
N$00012
  Top 0.4: U2.3 3.63,10.88 | 3.63,10.88 R10.1 | R11.1 3.67,10.85 3.63,10.88
N$00013
  Top 0.15: U1.P5 24,15 25,15 25.5,14.5 29.9,14.5 31,13.4 31,10.2 31.7,9.5 P5.TP
N$00014  (via drill 0.3)
  Top 0.4: v23,14.1 22.5,13.6 U1.N4 | N4.TP v30,8
  Bottom 0.15: v23,14.1 23.9,15 28.5,15 29.2,14.3 29.2,13.2 28.9,12.9 28.9,11.4 30,10.3 v30,8
N$00019
  Bottom 0.4: R24.2 33.15,24.6 DONE.C
N$00020
  Bottom 0.3: U6.2 26.8,23 26.3,22.5 L5.2
N$00021
  Bottom 0.3: U6.5 26.8,25.6 27,25.8 28.1,25.8 28.3,25.6 R27.2
  Bottom 0.6: R26.2 R27.2
N$00022
  Bottom 0.6: R18.1 31.15,14.95 32.1,14 JTAG.5
N$00027
  Bottom 0.6: R21.1 32.45,18.05 JTAG.3
N$00031
  Bottom 0.6: R15.1 32.25,11.75 JTAG.6
N$00040
  Bottom 0.3: U4.5 1.6,14.4 1.5,14.5 1.5,15.9 1.6,16 R19.2
  Bottom 0.6: R20.2 R19.2
N$00044
  Bottom 0.3: U3.5 1.6,8 1.5,8.1 1.5,9.5 1.6,9.6 R13.2
  Bottom 0.6: R14.2 R13.2
N$00045
  Bottom 0.3: U5.2 4.5,23 4.9,22.6 L4.2
N$00049
  Bottom 0.3: U5.5 1.6,23 1.5,23.1 1.5,24.5 1.6,24.6 R22.2
  Bottom 0.6: R23.2 R22.2
N$50
  Bottom 0.3: U3.2 4.5,8 4.9,7.6 L1.2
P2  (via drill 0.3)
  Top 0.25: J1.67 v25,2.3
  Top 0.4: U1.P2 v23.25,11.25
  Route14 0.1: v25,2.3 24.85,2.45 24.85,9.3 23.15,11 23.15,11.15 v23.25,11.25
P3
  Top 0.1: U1.P3 23.5,12.8 23.6,12.9 24.2,12.9 24.4,13.1 24.4,14.3 24.5,14.4 24.55,14.4 24.65,14.3 24.65,7.4 24.5,7.25 J1.66
P4
  Top 0.1: U1.P4 23.5,13.2 23.6,13.1 24.1,13.1 24.2,13.2 24.2,14.4 24.4,14.6 24.65,14.6 24.85,14.4 24.85,7.4 25,7.25 J1.68
PROG  (via drill 0.3)
  Top 0.4: U1.L7 v20,16
  Bottom 0.15: R17.2 20,15.45
  Bottom 0.4: 20,15.45 v20,16
PROG_DONE  (via drill 0.3)
  Top 0.4: U1.P9 v24,18.5
  Bottom 0.15: v24,18.5 24,17.2 24.2,17 28.3,17 28.5,17.2 28.5,19 29.5,20 30.3,20 30.5,20.2 30.5,25.8 30.7,26 R24.1
  Bottom 0.3: R24.1 31.85,26.2 R25.1
TCK  (via drill 0.3)
  Top 0.4: U1.A7 v10,16
  Bottom 0.15: v10,16 10.5,15.5 13.9,15.5 14.9,16.5 22.6,16.5 22.7,16.6 28.5,16.6 29,17.1 29,18.85 29.5,19.35 R21.2
TDI  (via drill 0.3)
  Top 0.4: U1.P7 v23.1,16.1
  Bottom 0.15: v23.1,16.1 23.2,16.2 30.45,16.2 R18.2
TDO
  Top 0.15: U1.P6 25.2,15.5 25.8,14.9 29.9,14.9 31,16 JTAG.4
TMS  (via drill 0.3)
  Top 0.4: U1.M6 v22,15
  Bottom 0.15: v22,15 22.5,15.5 23.5,15.5 23.8,15.8 28.5,15.8 29.6,14.7 29.6,13.25 29.8,13.05 R15.2
UART_CTS  (via drill 0.3)
  Top 0.4: U1.A10 v10,19.5
  Route14 0.15: v10,19.5 9.5,20 9.5,26.9 10,27.4 v10,31.8
  Bottom 0.25: J2.63 v10,31.8
UART_RTS  (via drill 0.3)
  Top 0.4: U1.B10 v11,19
  Route14 0.15: v11,19 11,26 10.5,26.5 v10.5,31.6
  Bottom 0.25: J2.61 v10.5,31.6
UART_RX  (via drill 0.3)
  Top 0.15: U1.A13 10,23 10,25.1 10.4,25.5 v10.4,25.9
  Bottom 0.25: J2.62 10.5,26 v10.4,25.9
UART_TX  (via drill 0.3)
  Top 0.4: U1.A12 v10,21.5
  Route14 0.15: v10,21.5 9.9,21.6 9.9,26.4 v10,26.5
  Bottom 0.25: J2.64 v10,26.5
VIO_34  (via drill 0.3)
  Top 0.4: U1.N2 v23,12 | v20,11 U1.K2 | U1.G2 v16.9,11.9 | v26.4,11 B34.2 | v26.7,11.3 27.7,11.3 B34.2 | v26.7,10.7 27.7,10.7 B34.2
  Bottom 0.4: v20,11 20.95,11 C10.2 | v26.7,11.3 v26.4,11 v26.7,10.7
  Bottom 0.5: C9.2 17.4,11.9 v16.9,11.9 | v23,12 C11.2 23.85,13 C14.2
  pour Route2 (rank 2): 26.9,11.5 25.5,11.5 24.5,12.5 21.8,12.5 20.6,11.3 19.9,11.3 19,12.2 16.7,12.2 16.7,11.5 18.7,11.5 19.7,10.5 21.2,10.5 22.4,11.7 24,11.7 25.2,10.5 26.9,10.5

## Text on the board
tNames: 1V8 | VIO | 3V3 | IN
bNames: OUT